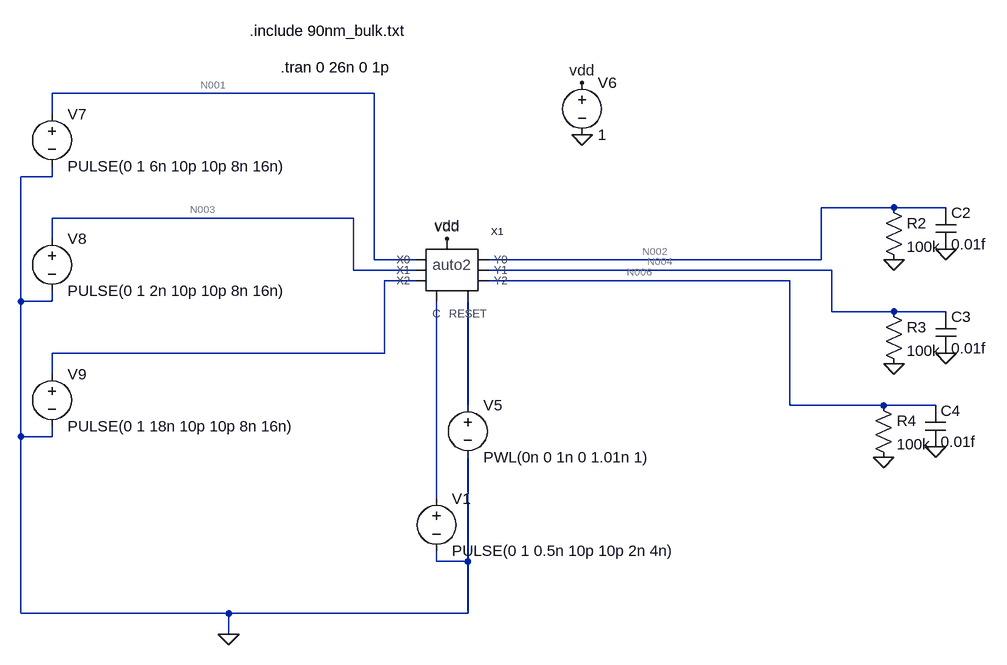
[diagram p0: schematic 4_exp1.asc]
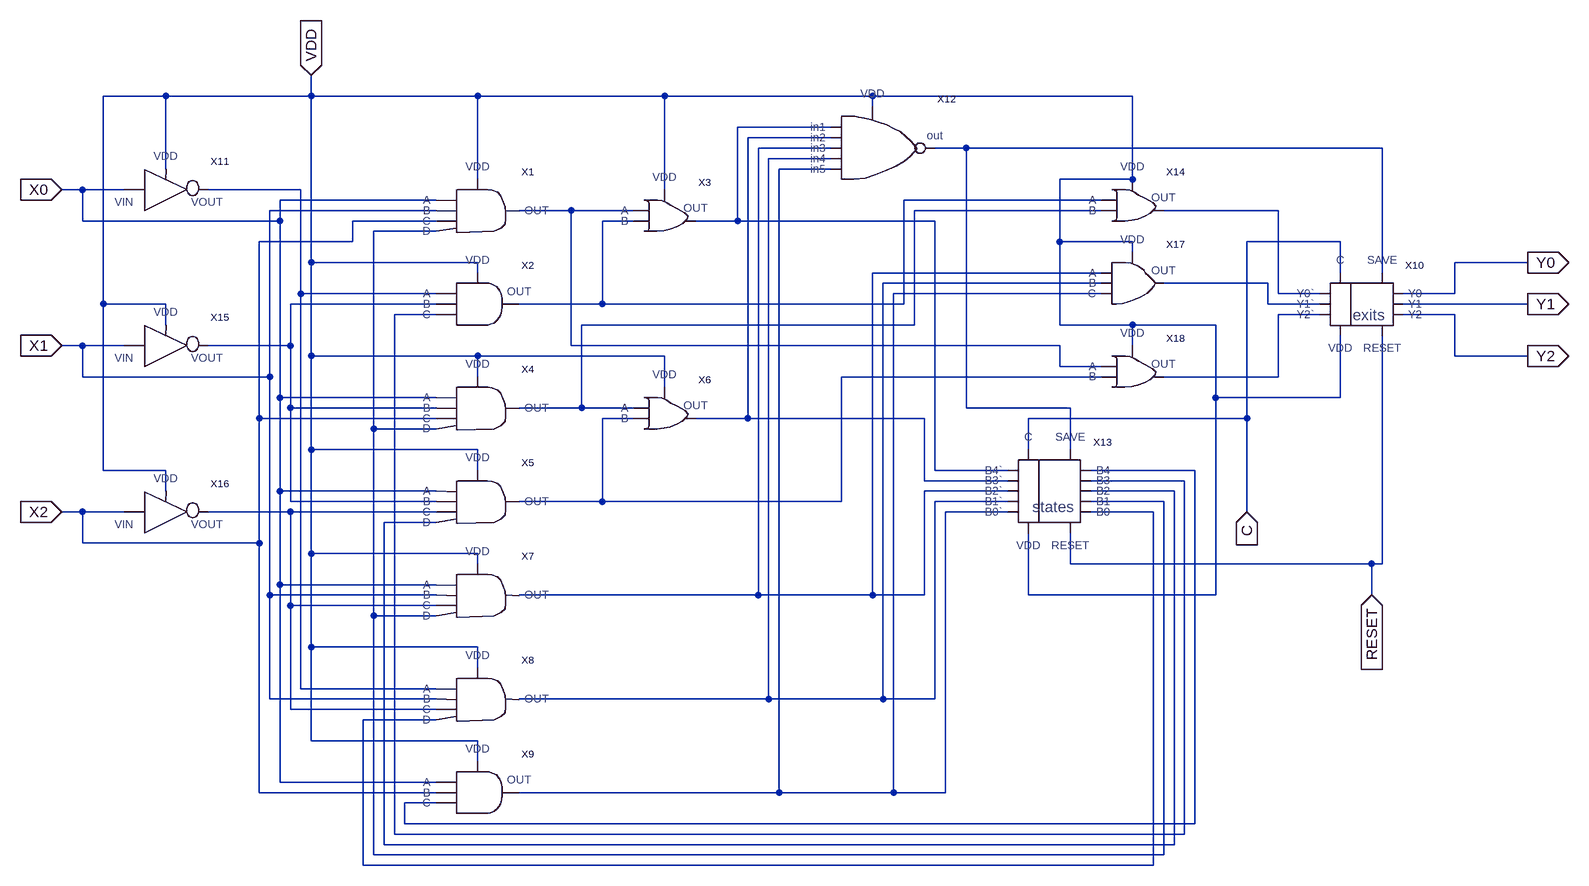
[diagram p1: sub-circuit 4_automat2.asc]
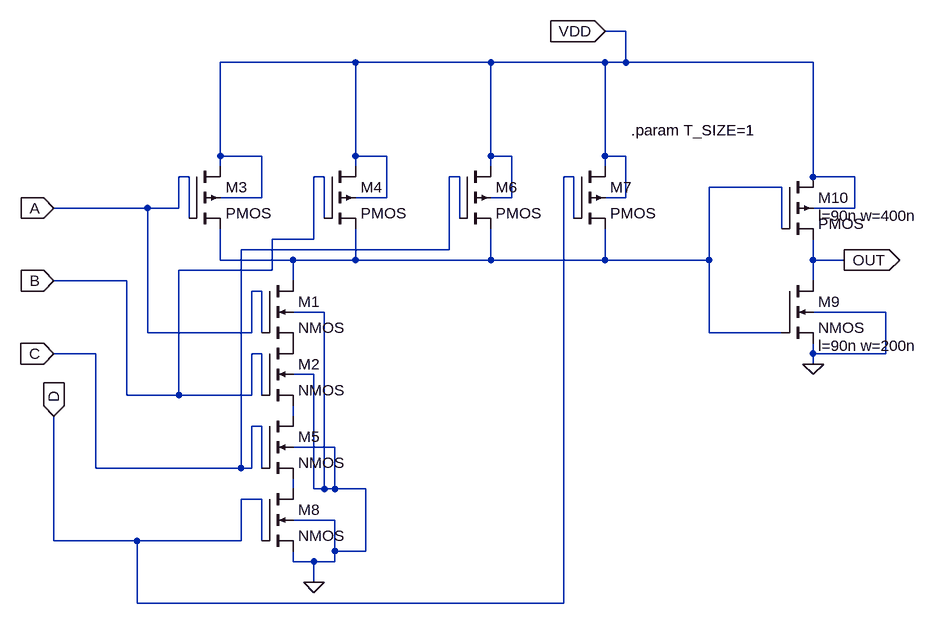
[diagram p2: sub-circuit and4.asc]
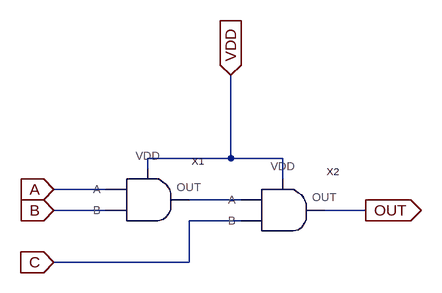
[diagram p3: sub-circuit and3.asc]
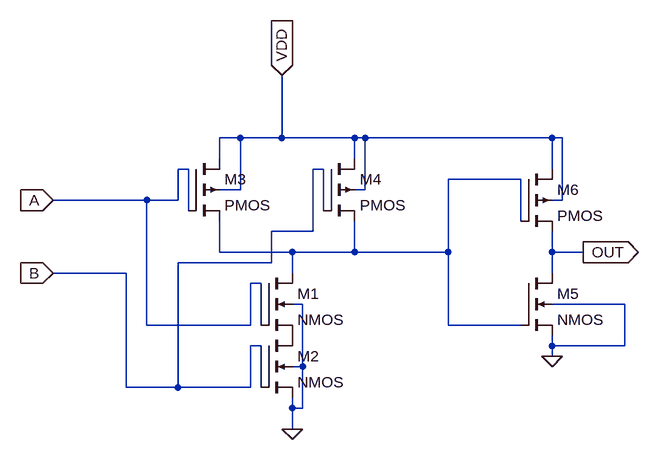
[diagram p4: sub-circuit and.asc]
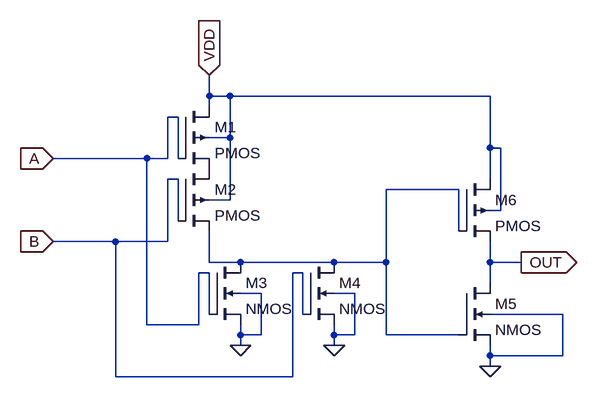
[diagram p5: sub-circuit or.asc]
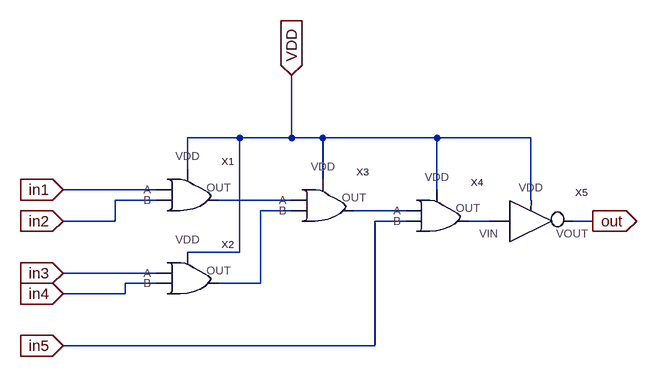
[diagram p6: sub-circuit nor5.asc]
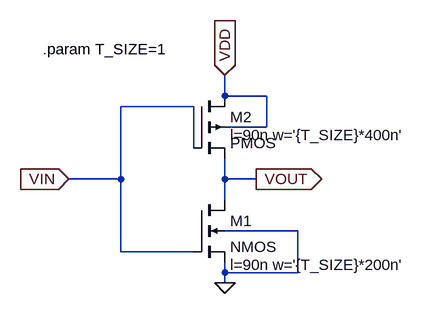
[diagram p7: sub-circuit inverter.asc]
4_exp1.asc, the LTspice schematic file:
Version 4
SHEET 1 2144 680
WIRE 1200 -176 704 -176
WIRE 704 -144 704 -176
WIRE 704 -48 704 -64
WIRE 704 -48 656 -48
WIRE 2000 0 1888 0
WIRE 2080 0 2000 0
WIRE 1168 16 704 16
WIRE 704 48 704 16
WIRE 1200 80 1200 -176
WIRE 1264 80 1200 80
WIRE 1888 80 1888 0
WIRE 1888 80 1376 80
WIRE 1168 96 1168 16
WIRE 1264 96 1168 96
WIRE 1904 96 1376 96
WIRE 1264 112 1216 112
WIRE 1840 112 1376 112
WIRE 656 144 656 -48
WIRE 704 144 704 128
WIRE 704 144 656 144
WIRE 1904 160 1904 96
WIRE 2000 160 1904 160
WIRE 2080 160 2000 160
WIRE 1216 224 1216 112
WIRE 1216 224 704 224
WIRE 704 256 704 224
WIRE 1344 304 1344 144
WIRE 1840 304 1840 112
WIRE 1984 304 1840 304
WIRE 2064 304 1984 304
WIRE 656 352 656 144
WIRE 704 352 704 336
WIRE 704 352 656 352
WIRE 1296 448 1296 144
WIRE 1296 544 1296 528
WIRE 1344 544 1344 384
WIRE 1344 544 1296 544
WIRE 656 624 656 352
WIRE 976 624 656 624
WIRE 1344 624 1344 544
WIRE 1344 624 976 624
WIRE 976 656 976 624
FLAG 1520 -192 vdd
FLAG 1520 -112 0
FLAG 976 656 0
FLAG 2000 80 0
FLAG 2080 64 0
FLAG 2000 240 0
FLAG 2080 224 0
FLAG 1984 384 0
FLAG 2064 368 0
FLAG 1312 48 vdd
SYMBOL voltage 1344 288 R0
WINDOW 123 0 0 Left 2
WINDOW 39 0 0 Left 2
SYMATTR InstName V5
SYMATTR Value PWL(0n 0 1n 0 1.01n 1)
SYMBOL voltage 1520 -208 R0
WINDOW 123 0 0 Left 2
WINDOW 39 0 0 Left 2
SYMATTR InstName V6
SYMATTR Value 1
SYMBOL voltage 1296 432 R0
WINDOW 123 0 0 Left 2
WINDOW 39 0 0 Left 2
SYMATTR InstName V1
SYMATTR Value PULSE(0 1 0.5n 10p 10p 2n 4n)
SYMBOL voltage 704 -160 R0
WINDOW 123 0 0 Left 2
WINDOW 39 0 0 Left 2
SYMATTR InstName V7
SYMATTR Value PULSE(0 1 6n 10p 10p 8n 16n)
SYMBOL voltage 704 32 R0
WINDOW 123 0 0 Left 2
WINDOW 39 0 0 Left 2
SYMATTR InstName V8
SYMATTR Value PULSE(0 1 2n 10p 10p 8n 16n)
SYMBOL voltage 704 240 R0
WINDOW 123 0 0 Left 2
WINDOW 39 0 0 Left 2
SYMATTR InstName V9
SYMATTR Value PULSE(0 1 18n 10p 10p 8n 16n)
SYMBOL res 1984 -16 R0
SYMATTR InstName R2
SYMATTR Value 100k
SYMBOL cap 2064 0 R0
SYMATTR InstName C2
SYMATTR Value 0.01f
SYMBOL res 1984 144 R0
SYMATTR InstName R3
SYMATTR Value 100k
SYMBOL cap 2064 160 R0
SYMATTR InstName C3
SYMATTR Value 0.01f
SYMBOL res 1968 288 R0
SYMATTR InstName R4
SYMATTR Value 100k
SYMBOL cap 2048 304 R0
SYMATTR InstName C4
SYMATTR Value 0.01f
SYMBOL 4_automat2 1312 112 R0
SYMATTR InstName X1
TEXT 1008 -272 Left 2 !.include 90nm_bulk.txt
TEXT 1056 -216 Left 2 !.tran 0 26n 0 1p

4_automat2.asc, the sub-circuit schematic file:
Version 4
SHEET 1 2060 1044
WIRE -288 -144 -384 -144
WIRE -64 -144 -64 -176
WIRE -64 -144 -288 -144
WIRE 192 -144 -64 -144
WIRE 480 -144 192 -144
WIRE 800 -144 480 -144
WIRE 1200 -144 800 -144
WIRE 800 -128 800 -144
WIRE 736 -96 592 -96
WIRE 736 -80 608 -80
WIRE 736 -64 624 -64
WIRE 944 -64 896 -64
WIRE 1584 -64 944 -64
WIRE 736 -48 640 -48
WIRE -288 -32 -288 -144
WIRE 736 -32 656 -32
WIRE 192 -16 192 -144
WIRE 1200 -16 1200 -144
WIRE 1200 -16 1088 -16
WIRE -416 0 -448 0
WIRE -352 0 -416 0
WIRE -80 0 -224 0
WIRE 480 0 480 -144
WIRE 128 16 -112 16
WIRE 1152 16 848 16
WIRE 128 32 -128 32
WIRE 336 32 256 32
WIRE 432 32 336 32
WIRE 1152 32 864 32
WIRE 1424 32 1248 32
WIRE -416 48 -416 0
WIRE -112 48 -112 16
WIRE -112 48 -416 48
WIRE 128 48 0 48
WIRE 432 48 384 48
WIRE 592 48 592 -96
WIRE 592 48 528 48
WIRE 896 48 592 48
WIRE 128 64 32 64
WIRE 0 80 0 48
WIRE 0 80 -144 80
WIRE 1088 80 1088 -16
WIRE 1200 80 1088 80
WIRE 1520 80 1376 80
WIRE 1200 96 1200 80
WIRE -64 112 -64 -144
WIRE 192 112 -64 112
WIRE 1808 112 1696 112
WIRE 192 128 192 112
WIRE 1152 128 800 128
WIRE 1520 128 1520 80
WIRE 1584 128 1584 -64
WIRE 1152 144 816 144
WIRE 1408 144 1248 144
WIRE -80 160 -80 0
WIRE 128 160 -80 160
WIRE 1152 160 832 160
WIRE 1424 160 1424 32
WIRE 1488 160 1424 160
WIRE 1696 160 1696 112
WIRE 1696 160 1616 160
WIRE -384 176 -384 -144
WIRE -288 176 -384 176
WIRE 128 176 -96 176
WIRE 384 176 384 48
WIRE 384 176 256 176
WIRE 848 176 848 16
WIRE 848 176 384 176
WIRE 1408 176 1408 144
WIRE 1488 176 1408 176
WIRE 1808 176 1616 176
WIRE 128 192 64 192
WIRE 1488 192 1424 192
WIRE 1696 192 1616 192
WIRE -288 208 -288 176
WIRE 864 208 864 32
WIRE 864 208 352 208
WIRE 1088 208 1088 80
WIRE 1200 208 1088 208
WIRE 1328 208 1200 208
WIRE -416 240 -448 240
WIRE -352 240 -416 240
WIRE -96 240 -96 176
WIRE -96 240 -224 240
WIRE 336 240 336 32
WIRE 1088 240 336 240
WIRE 1200 240 1200 208
WIRE -64 256 -64 112
WIRE 192 256 -64 256
WIRE 480 256 192 256
WIRE 1696 256 1696 192
WIRE 1808 256 1696 256
WIRE 1088 272 1088 240
WIRE 1152 272 1088 272
WIRE -416 288 -416 240
WIRE -128 288 -128 32
WIRE -128 288 -416 288
WIRE 192 288 192 256
WIRE 1152 288 752 288
WIRE 1424 288 1424 192
WIRE 1424 288 1248 288
WIRE 480 304 480 256
WIRE -112 320 -112 48
WIRE 128 320 -112 320
WIRE 1328 320 1328 208
WIRE 1520 320 1520 224
WIRE 1520 320 1328 320
WIRE -96 336 -96 240
WIRE 128 336 -96 336
WIRE 352 336 352 208
WIRE 352 336 256 336
WIRE 432 336 352 336
WIRE 944 336 944 -64
WIRE 1104 336 944 336
WIRE -144 352 -144 80
WIRE 128 352 -144 352
WIRE 432 352 384 352
WIRE 608 352 608 -80
WIRE 608 352 528 352
WIRE 880 352 608 352
WIRE 1376 352 1376 80
WIRE 1376 352 1040 352
WIRE 32 368 32 64
WIRE 128 368 32 368
WIRE -64 400 -64 256
WIRE 192 400 -64 400
WIRE 1040 400 1040 352
WIRE 1104 400 1104 336
WIRE -384 432 -384 176
WIRE -288 432 -384 432
WIRE 192 432 192 400
WIRE 896 432 896 48
WIRE 1008 432 896 432
WIRE 1296 432 1136 432
WIRE 880 448 880 352
WIRE 1008 448 880 448
WIRE 1280 448 1136 448
WIRE -288 464 -288 432
WIRE -112 464 -112 320
WIRE 128 464 -112 464
WIRE 1008 464 880 464
WIRE 1264 464 1136 464
WIRE -96 480 -96 336
WIRE 128 480 -96 480
WIRE 384 480 384 352
WIRE 384 480 256 480
WIRE 752 480 752 288
WIRE 752 480 384 480
WIRE 1008 480 896 480
WIRE 1248 480 1136 480
WIRE -416 496 -448 496
WIRE -352 496 -416 496
WIRE -96 496 -224 496
WIRE 128 496 -96 496
WIRE 1008 496 912 496
WIRE 1232 496 1136 496
WIRE 1376 496 1376 352
WIRE 128 512 48 512
WIRE -416 544 -416 496
WIRE -144 544 -144 352
WIRE -144 544 -416 544
WIRE -64 560 -64 400
WIRE 192 560 -64 560
WIRE 192 576 192 560
WIRE 1104 576 1104 528
WIRE 1568 576 1104 576
WIRE 1584 576 1584 224
WIRE 1584 576 1568 576
WIRE -112 608 -112 464
WIRE 128 608 -112 608
WIRE -128 624 -128 288
WIRE 128 624 -128 624
WIRE 624 624 624 -64
WIRE 624 624 256 624
WIRE 800 624 800 128
WIRE 800 624 624 624
WIRE 880 624 880 464
WIRE 880 624 800 624
WIRE 1040 624 1040 528
WIRE 1328 624 1328 320
WIRE 1328 624 1040 624
WIRE 1568 624 1568 576
WIRE -96 640 -96 496
WIRE 128 640 -96 640
WIRE 32 656 32 368
WIRE 128 656 32 656
WIRE -64 704 -64 560
WIRE 192 704 -64 704
WIRE 192 736 192 704
WIRE -80 768 -80 160
WIRE 128 768 -80 768
WIRE -128 784 -128 624
WIRE 128 784 -128 784
WIRE 640 784 640 -48
WIRE 640 784 256 784
WIRE 816 784 816 144
WIRE 816 784 640 784
WIRE 896 784 896 480
WIRE 896 784 816 784
WIRE -96 800 -96 640
WIRE 128 800 -96 800
WIRE 128 816 16 816
WIRE -64 848 -64 704
WIRE 192 848 -64 848
WIRE 192 880 192 848
WIRE -112 912 -112 608
WIRE 128 912 -112 912
WIRE -144 928 -144 544
WIRE 128 928 -144 928
WIRE 656 928 656 -32
WIRE 656 928 256 928
WIRE 832 928 832 160
WIRE 832 928 656 928
WIRE 912 928 912 496
WIRE 912 928 832 928
WIRE 128 944 80 944
WIRE 80 976 80 944
WIRE 1296 976 1296 432
WIRE 1296 976 80 976
WIRE 64 992 64 192
WIRE 1280 992 1280 448
WIRE 1280 992 64 992
WIRE 48 1008 48 512
WIRE 1264 1008 1264 464
WIRE 1264 1008 48 1008
WIRE 32 1024 32 656
WIRE 1248 1024 1248 480
WIRE 1248 1024 32 1024
WIRE 16 1040 16 816
WIRE 1232 1040 1232 496
WIRE 1232 1040 16 1040
FLAG 1808 112 Y0
IOPIN 1808 112 Out
FLAG 1808 176 Y1
IOPIN 1808 176 Out
FLAG 1808 256 Y2
IOPIN 1808 256 Out
FLAG 1376 496 C
IOPIN 1376 496 In
FLAG 1568 624 RESET
IOPIN 1568 624 In
FLAG -64 -176 VDD
IOPIN -64 -176 In
FLAG -448 0 X0
IOPIN -448 0 In
FLAG -448 240 X1
IOPIN -448 240 In
FLAG -448 496 X2
IOPIN -448 496 In
SYMBOL and4 208 48 R0
SYMATTR InstName X1
SYMBOL and3 192 176 R0
SYMATTR InstName X2
SYMBOL or 496 48 R0
SYMATTR InstName X3
SYMBOL and4 208 352 R0
SYMATTR InstName X4
SYMBOL and4 208 496 R0
SYMATTR InstName X5
SYMBOL or 496 352 R0
SYMATTR InstName X6
SYMBOL and4 208 640 R0
SYMATTR InstName X7
SYMBOL and4 208 800 R0
SYMATTR InstName X8
SYMBOL and3 192 928 R0
SYMATTR InstName X9
SYMBOL nor5 768 -64 R0
SYMATTR InstName X12
SYMBOL 4_saver 1072 464 R0
SYMATTR InstName X13
SYMBOL 4_exit_saver 1552 192 R0
SYMATTR InstName X10
SYMBOL or 1216 32 R0
SYMATTR InstName X14
SYMBOL or3 1200 144 R0
SYMATTR InstName X17
SYMBOL or 1216 288 R0
SYMATTR InstName X18
SYMBOL inverter -288 0 R0
SYMATTR InstName X11
SYMBOL inverter -288 240 R0
SYMATTR InstName X15
SYMBOL inverter -288 496 R0
SYMATTR InstName X16

and4.asc, the sub-circuit schematic file:
Version 4
SHEET 1 1276 740
WIRE 480 -256 448 -256
WIRE 64 -208 -144 -208
WIRE 272 -208 64 -208
WIRE 448 -208 272 -208
WIRE 480 -208 480 -256
WIRE 480 -208 448 -208
WIRE 768 -208 480 -208
WIRE -144 -64 -144 -208
WIRE -80 -64 -144 -64
WIRE 64 -64 64 -208
WIRE 112 -64 64 -64
WIRE 272 -64 272 -208
WIRE 304 -64 272 -64
WIRE 448 -64 448 -208
WIRE 480 -64 448 -64
WIRE -144 -48 -144 -64
WIRE 64 -48 64 -64
WIRE 272 -48 272 -64
WIRE 448 -48 448 -64
WIRE -192 -32 -208 -32
WIRE 16 -32 0 -32
WIRE 224 -32 208 -32
WIRE 400 -32 384 -32
WIRE 768 -32 768 -208
WIRE 832 -32 768 -32
WIRE 720 -16 608 -16
WIRE -80 0 -80 -64
WIRE -80 0 -144 0
WIRE 112 0 112 -64
WIRE 112 0 64 0
WIRE 304 0 304 -64
WIRE 304 0 272 0
WIRE 480 0 480 -64
WIRE 480 0 448 0
WIRE -256 16 -400 16
WIRE -208 16 -208 -32
WIRE -208 16 -256 16
WIRE 832 16 832 -32
WIRE 832 16 768 16
WIRE -192 32 -192 -32
WIRE 16 32 16 -32
WIRE 224 32 224 -32
WIRE 400 32 400 -32
WIRE 720 48 720 -16
WIRE 0 64 0 -32
WIRE 0 64 -64 64
WIRE 208 80 208 -32
WIRE 208 80 -112 80
WIRE -144 96 -144 48
WIRE -32 96 -144 96
WIRE 64 96 64 48
WIRE 64 96 -32 96
WIRE 272 96 272 48
WIRE 272 96 64 96
WIRE 448 96 448 48
WIRE 448 96 272 96
WIRE 608 96 608 -16
WIRE 608 96 448 96
WIRE 768 96 768 64
WIRE 816 96 768 96
WIRE -64 112 -64 64
WIRE -64 112 -208 112
WIRE -288 128 -400 128
WIRE -32 128 -32 96
WIRE 768 128 768 96
WIRE -80 144 -96 144
WIRE 16 176 -32 176
WIRE 880 176 768 176
WIRE -256 208 -256 16
WIRE -96 208 -96 144
WIRE -96 208 -256 208
WIRE -80 208 -80 144
WIRE 608 208 608 96
WIRE 720 208 608 208
WIRE -336 240 -400 240
WIRE -80 240 -96 240
WIRE 768 240 768 224
WIRE 880 240 880 176
WIRE 880 240 768 240
WIRE 768 256 768 240
WIRE 0 272 -32 272
WIRE -288 304 -288 128
WIRE -208 304 -208 112
WIRE -208 304 -288 304
WIRE -96 304 -96 240
WIRE -96 304 -208 304
WIRE -80 304 -80 240
WIRE -32 336 -32 320
WIRE -80 352 -96 352
WIRE 32 384 -32 384
WIRE -336 416 -336 240
WIRE -112 416 -112 80
WIRE -112 416 -336 416
WIRE -96 416 -96 352
WIRE -96 416 -112 416
WIRE -80 416 -80 352
WIRE -32 448 -32 432
WIRE 0 448 0 272
WIRE 16 448 16 176
WIRE 16 448 0 448
WIRE 32 448 32 384
WIRE 32 448 16 448
WIRE 80 448 32 448
WIRE -80 464 -112 464
WIRE 32 496 -32 496
WIRE -400 528 -400 336
WIRE -272 528 -400 528
WIRE -112 528 -112 464
WIRE -112 528 -272 528
WIRE -80 528 -80 464
WIRE 32 544 32 496
WIRE 80 544 80 448
WIRE 80 544 32 544
WIRE -32 560 -32 544
WIRE 0 560 -32 560
WIRE 32 560 32 544
WIRE 32 560 0 560
WIRE 0 592 0 560
WIRE -272 624 -272 528
WIRE 384 624 384 -32
WIRE 384 624 -272 624
FLAG -400 16 A
IOPIN -400 16 In
FLAG -400 128 B
IOPIN -400 128 In
FLAG -400 240 C
IOPIN -400 240 In
FLAG -400 336 D
IOPIN -400 336 In
FLAG 0 592 0
FLAG 768 256 0
FLAG 816 96 OUT
IOPIN 816 96 Out
FLAG 448 -256 VDD
IOPIN 448 -256 In
SYMBOL nmos4 -80 128 R0
SYMATTR InstName M1
SYMATTR Value2 l=90n w=200n
SYMBOL nmos4 -80 224 R0
SYMATTR InstName M2
SYMATTR Value2 l=90n w=200n
SYMBOL pmos4 -192 -48 R0
SYMATTR InstName M3
SYMATTR Value2 l=90n w=400n
SYMBOL pmos4 16 -48 R0
SYMATTR InstName M4
SYMATTR Value2 l=90n w=400n
SYMBOL nmos4 -80 336 R0
SYMATTR InstName M5
SYMATTR Value2 l=90n w=200n
SYMBOL pmos4 224 -48 R0
SYMATTR InstName M6
SYMATTR Value2 l=90n w=400n
SYMBOL pmos4 400 -48 R0
SYMATTR InstName M7
SYMATTR Value2 l=90n w=400n
SYMBOL nmos4 -80 448 R0
SYMATTR InstName M8
SYMATTR Value2 l=90n w=200n
SYMBOL nmos4 720 128 R0
WINDOW 123 56 100 Left 2
SYMATTR Value2 l=90n w=200n
SYMATTR InstName M9
SYMBOL pmos4 720 -32 R0
WINDOW 123 56 60 Left 2
SYMATTR Value2 l=90n w=400n
SYMATTR InstName M10
TEXT 488 -104 Left 2 !.param T_SIZE=1

and3.asc, the sub-circuit schematic file:
Version 4
SHEET 1 880 680
WIRE 208 16 208 -112
WIRE 208 16 80 16
WIRE 288 16 208 16
WIRE 80 32 80 16
WIRE 288 48 288 16
WIRE 16 64 -64 64
WIRE 224 80 144 80
WIRE 16 96 -64 96
WIRE 416 96 352 96
WIRE 224 112 144 112
WIRE 144 176 144 112
WIRE 144 176 -64 176
FLAG -64 64 A
IOPIN -64 64 In
FLAG -64 96 B
IOPIN -64 96 In
FLAG -64 176 C
IOPIN -64 176 In
FLAG 416 96 OUT
IOPIN 416 96 Out
FLAG 208 -112 VDD
IOPIN 208 -112 In
SYMBOL and 64 80 R0
SYMATTR InstName X1
SYMBOL and 272 96 R0
SYMATTR InstName X2

and.asc, the sub-circuit schematic file:
Version 4
SHEET 1 1116 788
WIRE 112 -32 80 -32
WIRE 176 -32 176 -128
WIRE 176 -32 112 -32
WIRE 288 -32 176 -32
WIRE 304 -32 288 -32
WIRE 592 -32 304 -32
WIRE 608 -32 592 -32
WIRE 80 0 80 -32
WIRE 288 0 288 -32
WIRE 32 16 16 16
WIRE 240 16 224 16
WIRE 592 16 592 -32
WIRE 544 32 432 32
WIRE 112 48 112 -32
WIRE 112 48 80 48
WIRE 304 48 304 -32
WIRE 304 48 288 48
WIRE -32 64 -176 64
WIRE 16 64 16 16
WIRE 16 64 -32 64
WIRE 608 64 608 -32
WIRE 608 64 592 64
WIRE 32 80 32 16
WIRE 240 80 240 16
WIRE 544 96 544 32
WIRE 224 112 224 16
WIRE 224 112 160 112
WIRE 80 144 80 96
WIRE 192 144 80 144
WIRE 288 144 288 96
WIRE 288 144 192 144
WIRE 432 144 432 32
WIRE 432 144 288 144
WIRE 592 144 592 112
WIRE 640 144 592 144
WIRE 160 160 160 112
WIRE 160 160 16 160
WIRE -64 176 -176 176
WIRE 192 176 192 144
WIRE 592 176 592 144
WIRE 144 192 128 192
WIRE 208 224 192 224
WIRE 704 224 592 224
WIRE -32 256 -32 64
WIRE 128 256 128 192
WIRE 128 256 -32 256
WIRE 144 256 144 192
WIRE 432 256 432 144
WIRE 544 256 432 256
WIRE 144 288 128 288
WIRE 592 288 592 272
WIRE 704 288 704 224
WIRE 704 288 592 288
WIRE 592 304 592 288
WIRE 208 320 208 224
WIRE 208 320 192 320
WIRE -64 352 -64 176
WIRE 16 352 16 160
WIRE 16 352 -64 352
WIRE 128 352 128 288
WIRE 128 352 16 352
WIRE 144 352 144 288
WIRE 192 384 192 368
WIRE 208 384 208 320
WIRE 208 384 192 384
WIRE 192 416 192 384
FLAG 192 416 0
FLAG -176 64 A
IOPIN -176 64 In
FLAG -176 176 B
IOPIN -176 176 In
FLAG 176 -128 VDD
IOPIN 176 -128 In
FLAG 592 304 0
FLAG 640 144 OUT
IOPIN 640 144 Out
SYMBOL nmos4 144 176 R0
SYMATTR InstName M1
SYMATTR Value2 l=90n w=200n
SYMBOL nmos4 144 272 R0
SYMATTR InstName M2
SYMATTR Value2 l=90n w=200n
SYMBOL pmos4 32 0 R0
SYMATTR InstName M3
SYMATTR Value2 l=90n w=400n
SYMBOL pmos4 240 0 R0
SYMATTR InstName M4
SYMATTR Value2 l=90n w=400n
SYMBOL nmos4 544 176 R0
SYMATTR Value2 l=90n w=200n
SYMATTR InstName M5
SYMBOL pmos4 544 16 R0
SYMATTR Value2 l=90n w=400n
SYMATTR InstName M6

or.asc, the sub-circuit schematic file:
Version 4
SHEET 1 1084 680
WIRE 32 -32 32 -64
WIRE 64 -32 32 -32
WIRE 464 -32 64 -32
WIRE 32 -16 32 -32
WIRE -16 0 -32 0
WIRE 64 32 64 -32
WIRE 64 32 32 32
WIRE 464 48 464 -32
WIRE 480 48 464 48
WIRE -64 64 -208 64
WIRE -32 64 -32 0
WIRE -32 64 -64 64
WIRE -16 64 -16 0
WIRE -16 96 -32 96
WIRE 464 96 464 48
WIRE 416 112 304 112
WIRE 64 128 64 32
WIRE 64 128 32 128
WIRE 480 144 480 48
WIRE 480 144 464 144
WIRE -16 160 -16 96
WIRE 416 176 416 112
WIRE -112 192 -208 192
WIRE -32 192 -32 96
WIRE -32 192 -112 192
WIRE 32 224 32 176
WIRE 80 224 32 224
WIRE 224 224 80 224
WIRE 304 224 304 112
WIRE 304 224 224 224
WIRE 464 224 464 192
WIRE 512 224 464 224
WIRE 32 240 16 240
WIRE 176 240 160 240
WIRE 464 256 464 224
WIRE 112 272 80 272
WIRE 256 272 224 272
WIRE 32 304 32 240
WIRE 176 304 176 240
WIRE 576 304 464 304
WIRE -64 320 -64 64
WIRE 16 320 16 240
WIRE 16 320 -64 320
WIRE 80 336 80 320
WIRE 112 336 112 272
WIRE 112 336 80 336
WIRE 224 336 224 320
WIRE 256 336 256 272
WIRE 256 336 224 336
WIRE 304 336 304 224
WIRE 416 336 304 336
WIRE 80 352 80 336
WIRE 224 352 224 336
WIRE 464 368 464 352
WIRE 576 368 576 304
WIRE 576 368 464 368
WIRE 464 384 464 368
WIRE -112 400 -112 192
WIRE 160 400 160 240
WIRE 160 400 -112 400
FLAG 32 -64 VDD
IOPIN 32 -64 In
FLAG 80 352 0
FLAG 224 352 0
FLAG -208 64 A
IOPIN -208 64 In
FLAG -208 192 B
IOPIN -208 192 In
FLAG 464 384 0
FLAG 512 224 OUT
IOPIN 512 224 Out
SYMBOL pmos4 -16 -16 R0
SYMATTR InstName M1
SYMATTR Value2 l=90n w=400n
SYMBOL pmos4 -16 80 R0
SYMATTR InstName M2
SYMATTR Value2 l=90n w=400n
SYMBOL nmos4 32 224 R0
SYMATTR InstName M3
SYMATTR Value2 l=90n w=200n
SYMBOL nmos4 176 224 R0
SYMATTR InstName M4
SYMATTR Value2 l=90n w=200n
SYMBOL nmos4 416 256 R0
SYMATTR Value2 l=90n w=200n
SYMATTR InstName M5
SYMBOL pmos4 416 96 R0
SYMATTR Value2 l=90n w=400n
SYMATTR InstName M6

nor5.asc, the sub-circuit schematic file:
Version 4
SHEET 1 880 680
WIRE 192 16 112 16
WIRE 272 16 272 -80
WIRE 272 16 192 16
WIRE 320 16 272 16
WIRE 496 16 320 16
WIRE 640 16 496 16
WIRE 112 64 112 16
WIRE 320 80 320 16
WIRE 64 96 -80 96
WIRE 496 96 496 16
WIRE 64 112 0 112
WIRE 272 112 160 112
WIRE 640 112 640 16
WIRE 272 128 224 128
WIRE 448 128 368 128
WIRE 0 144 0 112
WIRE 0 144 -80 144
WIRE 448 144 400 144
WIRE 576 144 544 144
WIRE 736 144 704 144
WIRE 192 192 192 16
WIRE 192 192 112 192
WIRE 64 224 -80 224
WIRE 64 240 16 240
WIRE 224 240 224 128
WIRE 224 240 160 240
WIRE 16 256 16 240
WIRE 16 256 -80 256
WIRE 400 336 400 144
WIRE 400 336 -80 336
FLAG -80 96 in1
IOPIN -80 96 In
FLAG -80 144 in2
IOPIN -80 144 In
FLAG -80 224 in3
IOPIN -80 224 In
FLAG -80 256 in4
IOPIN -80 256 In
FLAG -80 336 in5
IOPIN -80 336 In
FLAG 272 -80 VDD
IOPIN 272 -80 In
FLAG 736 144 out
IOPIN 736 144 Out
SYMBOL or 128 112 R0
SYMATTR InstName X1
SYMBOL or 128 240 R0
SYMATTR InstName X2
SYMBOL or 336 128 R0
SYMATTR InstName X3
SYMBOL or 512 144 R0
SYMATTR InstName X4
SYMBOL inverter 640 144 R0
SYMATTR InstName X5

inverter.asc, the sub-circuit schematic file:
Version 4
SHEET 1 880 680
WIRE 176 -128 176 -160
WIRE 240 -128 176 -128
WIRE 128 -112 16 -112
WIRE 240 -80 240 -128
WIRE 240 -80 176 -80
WIRE 128 -48 128 -112
WIRE 16 0 16 -112
WIRE 16 0 -64 0
WIRE 176 0 176 -32
WIRE 224 0 176 0
WIRE 176 32 176 0
WIRE 288 80 176 80
WIRE 16 112 16 0
WIRE 128 112 16 112
WIRE 176 144 176 128
WIRE 288 144 288 80
WIRE 288 144 176 144
WIRE 176 160 176 144
FLAG 176 160 0
FLAG -64 0 VIN
IOPIN -64 0 In
FLAG 224 0 VOUT
IOPIN 224 0 Out
FLAG 176 -160 VDD
IOPIN 176 -160 In
SYMBOL nmos4 128 32 R0
WINDOW 123 56 100 Left 2
SYMATTR InstName M1
SYMATTR Value2 l=90n w='{T_SIZE}*200n'
SYMBOL pmos4 128 -128 R0
WINDOW 123 56 60 Left 2
SYMATTR InstName M2
SYMATTR Value2 l=90n w='{T_SIZE}*400n'
TEXT -104 -200 Left 2 !.param T_SIZE=1

4_saver.asc, the sub-circuit schematic file:
Version 4
SHEET 1 2252 1400
WIRE 960 -304 896 -304
WIRE 1136 -304 1136 -400
WIRE 1136 -304 960 -304
WIRE 960 -288 960 -304
WIRE 896 -256 896 -304
WIRE 912 -256 896 -256
WIRE 848 -240 848 -352
WIRE 912 -240 848 -240
WIRE 1024 -240 1008 -240
WIRE 1120 -112 880 -112
WIRE 1136 -112 1136 -304
WIRE 1136 -112 1120 -112
WIRE 1264 -112 1136 -112
WIRE 880 -80 880 -112
WIRE 1120 -64 1120 -112
WIRE 736 -48 736 -352
WIRE 816 -48 736 -48
WIRE 960 -32 944 -32
WIRE 1056 -32 960 -32
WIRE 816 -16 784 -16
WIRE 1408 -16 1184 -16
WIRE 1024 0 1024 -240
WIRE 1056 0 1024 0
WIRE 960 32 960 -32
WIRE 960 32 816 32
WIRE 784 48 784 -16
WIRE 784 48 624 48
WIRE 1120 48 880 48
WIRE 1120 64 1120 48
WIRE 1264 64 1264 -112
WIRE 1264 64 1120 64
WIRE 1488 64 1264 64
WIRE 816 80 816 32
WIRE 976 80 944 80
WIRE 976 96 976 80
WIRE 1056 96 976 96
WIRE 1488 96 1488 64
WIRE 1296 112 1184 112
WIRE 1024 128 1024 0
WIRE 1056 128 1024 128
WIRE 1408 128 1408 -16
WIRE 1440 128 1408 128
WIRE 1632 128 1536 128
WIRE 1376 144 1376 -64
WIRE 1440 144 1376 144
WIRE 1296 160 1296 112
WIRE 1440 160 1296 160
WIRE 1584 160 1536 160
WIRE 1120 192 880 192
WIRE 1264 192 1264 64
WIRE 1264 192 1120 192
WIRE 1488 192 1264 192
WIRE 1120 208 1120 192
WIRE 736 224 736 -48
WIRE 816 224 736 224
WIRE 1056 240 944 240
WIRE 1488 240 1488 192
WIRE 816 256 768 256
WIRE 1408 256 1184 256
WIRE 1024 272 1024 128
WIRE 1056 272 1024 272
WIRE 1408 272 1408 256
WIRE 1440 272 1408 272
WIRE 1632 272 1536 272
WIRE 944 288 944 240
WIRE 944 288 816 288
WIRE 1376 288 1376 144
WIRE 1440 288 1376 288
WIRE 768 304 768 256
WIRE 768 304 624 304
WIRE 1440 304 1408 304
WIRE 1584 304 1536 304
WIRE 1120 320 880 320
WIRE 1264 320 1264 192
WIRE 1264 320 1120 320
WIRE 1120 336 1120 320
WIRE 816 352 816 288
WIRE 944 368 944 352
WIRE 1056 368 944 368
WIRE 1408 384 1408 304
WIRE 1408 384 1184 384
WIRE 1024 400 1024 272
WIRE 1056 400 1024 400
WIRE 1264 400 1264 320
WIRE 1488 400 1264 400
WIRE 1440 432 1280 432
WIRE 1632 432 1536 432
WIRE 1376 448 1376 288
WIRE 1440 448 1376 448
WIRE 1120 464 880 464
WIRE 1440 464 1296 464
WIRE 1584 464 1536 464
WIRE 1120 480 1120 464
WIRE 1264 480 1264 400
WIRE 1264 480 1120 480
WIRE 736 496 736 224
WIRE 816 496 736 496
WIRE 1056 512 944 512
WIRE 816 528 768 528
WIRE 1280 528 1280 432
WIRE 1280 528 1184 528
WIRE 1024 544 1024 400
WIRE 1056 544 1024 544
WIRE 1264 544 1264 480
WIRE 1488 544 1264 544
WIRE 944 560 944 512
WIRE 944 560 816 560
WIRE 768 576 768 528
WIRE 768 576 624 576
WIRE 1440 576 1312 576
WIRE 1632 576 1536 576
WIRE 1120 592 880 592
WIRE 1264 592 1264 544
WIRE 1264 592 1120 592
WIRE 1376 592 1376 448
WIRE 1440 592 1376 592
WIRE 1120 608 1120 592
WIRE 1440 608 1328 608
WIRE 1584 608 1536 608
WIRE 816 624 816 560
WIRE 944 640 944 624
WIRE 1056 640 944 640
WIRE 1296 656 1296 464
WIRE 1296 656 1184 656
WIRE 1024 672 1024 544
WIRE 1056 672 1024 672
WIRE 1264 688 1264 592
WIRE 1488 688 1264 688
WIRE 1440 720 1360 720
WIRE 1632 720 1536 720
WIRE 1120 736 880 736
WIRE 1264 736 1264 688
WIRE 1264 736 1120 736
WIRE 1376 736 1376 592
WIRE 1440 736 1376 736
WIRE 1120 752 1120 736
WIRE 1440 752 1392 752
WIRE 1584 752 1536 752
WIRE 736 768 736 496
WIRE 816 768 736 768
WIRE 1056 784 944 784
WIRE 816 800 768 800
WIRE 1312 800 1312 576
WIRE 1312 800 1184 800
WIRE 1024 816 1024 672
WIRE 1056 816 1024 816
WIRE 768 832 768 800
WIRE 768 832 624 832
WIRE 944 832 944 784
WIRE 944 832 816 832
WIRE 1120 864 880 864
WIRE 1264 864 1264 736
WIRE 1264 864 1120 864
WIRE 1120 880 1120 864
WIRE 816 896 816 832
WIRE 944 912 944 896
WIRE 1056 912 944 912
WIRE 1328 928 1328 608
WIRE 1328 928 1184 928
WIRE 1024 944 1024 816
WIRE 1056 944 1024 944
WIRE 1008 1024 880 1024
WIRE 1120 1024 1008 1024
WIRE 1264 1024 1264 864
WIRE 1264 1024 1120 1024
WIRE 880 1040 880 1024
WIRE 1120 1056 1120 1024
WIRE 736 1072 736 768
WIRE 816 1072 736 1072
WIRE 960 1088 944 1088
WIRE 1056 1088 976 1088
WIRE 816 1104 768 1104
WIRE 1360 1104 1360 720
WIRE 1360 1104 1184 1104
WIRE 1024 1120 1024 944
WIRE 1056 1120 1024 1120
WIRE 768 1136 768 1104
WIRE 768 1136 624 1136
WIRE 960 1136 960 1088
WIRE 960 1136 800 1136
WIRE 1264 1168 1264 1024
WIRE 1264 1168 1120 1168
WIRE 992 1184 880 1184
WIRE 1008 1184 1008 1024
WIRE 1008 1184 992 1184
WIRE 1120 1184 1120 1168
WIRE 736 1200 736 1072
WIRE 736 1200 608 1200
WIRE 800 1216 800 1136
WIRE 832 1216 800 1216
WIRE 1056 1216 1008 1216
WIRE 832 1232 784 1232
WIRE 976 1232 976 1088
WIRE 976 1232 928 1232
WIRE 1392 1232 1392 752
WIRE 1392 1232 1184 1232
WIRE 1024 1248 1024 1120
WIRE 1056 1248 1024 1248
WIRE 928 1264 928 1232
WIRE 928 1264 832 1264
WIRE 992 1296 992 1184
WIRE 992 1296 688 1296
WIRE 992 1312 992 1296
WIRE 992 1312 928 1312
WIRE 688 1328 688 1296
WIRE 832 1344 832 1264
WIRE 864 1344 832 1344
WIRE 1008 1344 1008 1216
WIRE 1008 1344 992 1344
WIRE 608 1360 608 1200
WIRE 624 1360 608 1360
WIRE 784 1360 784 1232
WIRE 784 1360 752 1360
FLAG 1376 -64 C
IOPIN 1376 -64 In
FLAG 1632 128 B4
IOPIN 1632 128 Out
FLAG 1632 272 B3
IOPIN 1632 272 Out
FLAG 1632 432 B2
IOPIN 1632 432 Out
FLAG 1632 576 B1
IOPIN 1632 576 Out
FLAG 1632 720 B0
IOPIN 1632 720 Out
FLAG 848 -352 SAVE
IOPIN 848 -352 In
FLAG 736 -352 RESET
IOPIN 736 -352 In
FLAG 624 48 B4`
IOPIN 624 48 In
FLAG 624 576 B2`
IOPIN 624 576 In
FLAG 624 304 B3`
IOPIN 624 304 In
FLAG 624 832 B1`
IOPIN 624 832 In
FLAG 624 1136 B0`
IOPIN 624 1136 In
FLAG 1136 -400 VDD
IOPIN 1136 -400 In
SYMBOL and 864 -32 R0
SYMATTR InstName X15
SYMBOL and 1104 -16 R0
SYMATTR InstName X17
SYMBOL and 1104 112 R0
SYMATTR InstName X18
SYMBOL and 864 240 R0
SYMATTR InstName X24
SYMBOL and 1104 256 R0
SYMATTR InstName X26
SYMBOL and 1104 384 R0
SYMATTR InstName X27
SYMBOL and 864 512 R0
SYMATTR InstName X28
SYMBOL and 1104 528 R0
SYMATTR InstName X30
SYMBOL and 1104 656 R0
SYMATTR InstName X31
SYMBOL and 864 784 R0
SYMATTR InstName X32
SYMBOL and 1104 800 R0
SYMATTR InstName X34
SYMBOL and 1104 928 R0
SYMATTR InstName X35
SYMBOL jk-front 1488 160 R0
SYMATTR InstName X19
SYMBOL jk-front 1488 304 R0
SYMATTR InstName X20
SYMBOL jk-front 1488 464 R0
SYMATTR InstName X21
SYMBOL jk-front 1488 608 R0
SYMATTR InstName X22
SYMBOL jk-front 1488 752 R0
SYMATTR InstName X23
SYMBOL and 864 1088 R0
SYMATTR InstName X14
SYMBOL and 1104 1104 R0
SYMATTR InstName X38
SYMBOL and 1104 1232 R0
SYMATTR InstName X39
SYMBOL xor 960 -240 R0
SYMATTR InstName X40
SYMBOL inverter 880 80 R0
SYMATTR InstName X1
SYMBOL inverter 880 352 R0
SYMATTR InstName X2
SYMBOL inverter 880 624 R0
SYMATTR InstName X3
SYMBOL inverter 880 896 R0
SYMATTR InstName X4
SYMBOL or 896 1232 R0
SYMATTR InstName X5
SYMBOL inverter 688 1360 R0
SYMATTR InstName X6
SYMBOL inverter 928 1344 R0
SYMATTR InstName X7

jk-front.asc, the sub-circuit schematic file:
Version 4
SHEET 1 1588 680
WIRE 1472 -48 -32 -48
WIRE 192 0 80 0
WIRE 352 0 192 0
WIRE 592 0 592 -272
WIRE 592 0 352 0
WIRE 688 0 592 0
WIRE 1008 0 688 0
WIRE 1280 0 1008 0
WIRE 80 16 80 0
WIRE 352 32 352 0
WIRE -32 48 -32 -48
WIRE 16 48 -32 48
WIRE 688 48 688 0
WIRE 288 64 144 64
WIRE 1008 64 1008 0
WIRE 16 80 -96 80
WIRE 624 80 432 80
WIRE 1280 80 1280 0
WIRE 288 96 208 96
WIRE 816 96 768 96
WIRE 944 96 816 96
WIRE 624 112 576 112
WIRE 1216 112 1088 112
WIRE 944 128 896 128
WIRE 1456 128 1360 128
WIRE 1504 128 1456 128
WIRE 192 144 192 0
WIRE 192 144 16 144
WIRE 1216 144 1168 144
WIRE -80 176 -96 176
WIRE -48 176 -80 176
WIRE 208 176 208 96
WIRE 208 176 80 176
WIRE 816 176 816 96
WIRE 816 176 544 176
WIRE 576 208 576 112
WIRE 848 208 576 208
WIRE 1168 224 1168 144
WIRE 1424 224 1168 224
WIRE 192 240 192 144
WIRE 192 240 80 240
WIRE 320 240 192 240
WIRE 688 240 320 240
WIRE 1008 240 688 240
WIRE 1280 240 1008 240
WIRE 320 256 320 240
WIRE 16 272 -16 272
WIRE 688 272 688 240
WIRE 1360 272 1360 128
WIRE 1360 272 1168 272
WIRE 256 288 144 288
WIRE 1008 288 1008 240
WIRE 16 304 -96 304
WIRE 624 304 400 304
WIRE 1280 304 1280 240
WIRE 208 320 208 176
WIRE 256 320 208 320
WIRE 848 320 848 208
WIRE 848 320 768 320
WIRE 944 320 848 320
WIRE 544 336 544 176
WIRE 624 336 544 336
WIRE 1216 336 1088 336
WIRE 896 352 896 128
WIRE 944 352 896 352
WIRE 1424 352 1424 224
WIRE 1424 352 1360 352
WIRE 1472 352 1472 -48
WIRE 1472 352 1424 352
WIRE 1504 352 1472 352
WIRE 1168 368 1168 272
WIRE 1216 368 1168 368
WIRE -80 480 -80 176
WIRE 896 480 896 352
WIRE 896 480 -80 480
WIRE -16 560 -16 272
WIRE 1456 560 1456 128
WIRE 1456 560 -16 560
FLAG -96 80 J
IOPIN -96 80 In
FLAG -96 176 C
IOPIN -96 176 In
FLAG -96 304 K
IOPIN -96 304 In
FLAG 1504 128 Q
IOPIN 1504 128 Out
FLAG 1504 352 !Q
IOPIN 1504 352 Out
FLAG 592 -272 VDD
IOPIN 592 -272 In
SYMBOL and 64 64 R0
SYMATTR InstName X1
SYMBOL and 64 288 R0
SYMATTR InstName X2
SYMBOL nand 352 80 R0
SYMATTR InstName X3
SYMBOL nand 320 304 R0
SYMATTR InstName X4
SYMBOL nand 688 96 R0
SYMATTR InstName X5
SYMBOL nand 688 320 R0
SYMATTR InstName X6
SYMBOL nand 1008 112 R0
SYMATTR InstName X8
SYMBOL nand 1008 336 R0
SYMATTR InstName X9
SYMBOL nand 1280 128 R0
SYMATTR InstName X10
SYMBOL nand 1280 352 R0
SYMATTR InstName X11
SYMBOL inverter 16 176 R0
SYMATTR InstName X12

nand.asc, the sub-circuit schematic file:
Version 4
SHEET 1 880 680
WIRE 144 -80 112 -80
WIRE 208 -80 208 -176
WIRE 208 -80 144 -80
WIRE 320 -80 208 -80
WIRE 336 -80 320 -80
WIRE 112 -48 112 -80
WIRE 320 -48 320 -80
WIRE 64 -32 48 -32
WIRE 272 -32 256 -32
WIRE 144 0 144 -80
WIRE 144 0 112 0
WIRE 336 0 336 -80
WIRE 336 0 320 0
WIRE 0 16 -144 16
WIRE 48 16 48 -32
WIRE 48 16 0 16
WIRE 64 32 64 -32
WIRE 272 32 272 -32
WIRE 256 64 256 -32
WIRE 256 64 192 64
WIRE 112 96 112 48
WIRE 224 96 112 96
WIRE 320 96 320 48
WIRE 320 96 224 96
WIRE 448 96 320 96
WIRE 192 112 192 64
WIRE 192 112 48 112
WIRE -32 128 -144 128
WIRE 224 128 224 96
WIRE 176 144 160 144
WIRE 240 176 224 176
WIRE 0 208 0 16
WIRE 160 208 160 144
WIRE 160 208 0 208
WIRE 176 208 176 144
WIRE 176 240 160 240
WIRE 240 272 240 176
WIRE 240 272 224 272
WIRE -32 304 -32 128
WIRE 48 304 48 112
WIRE 48 304 -32 304
WIRE 160 304 160 240
WIRE 160 304 48 304
WIRE 176 304 176 240
WIRE 224 336 224 320
WIRE 240 336 240 272
WIRE 240 336 224 336
WIRE 224 368 224 336
FLAG 224 368 0
FLAG 448 96 OUT
IOPIN 448 96 Out
FLAG -144 16 A
IOPIN -144 16 In
FLAG -144 128 B
IOPIN -144 128 In
FLAG 208 -176 VDD
IOPIN 208 -176 In
SYMBOL nmos4 176 128 R0
SYMATTR InstName M1
SYMATTR Value2 l=90n w=200n
SYMBOL nmos4 176 224 R0
SYMATTR InstName M2
SYMATTR Value2 l=90n w=200n
SYMBOL pmos4 64 -48 R0
SYMATTR InstName M3
SYMATTR Value2 l=90n w=400n
SYMBOL pmos4 272 -48 R0
SYMATTR InstName M4
SYMATTR Value2 l=90n w=400n

xor.asc, the sub-circuit schematic file:
Version 4
SHEET 1 1104 680
WIRE 416 -112 416 -208
WIRE 416 -112 240 -112
WIRE 448 -112 416 -112
WIRE 544 -112 448 -112
WIRE 832 -112 544 -112
WIRE 544 -32 544 -112
WIRE 480 0 112 0
WIRE 688 16 624 16
WIRE 480 32 416 32
WIRE 112 48 112 0
WIRE 112 48 80 48
WIRE 240 64 240 -112
WIRE 832 80 832 -112
WIRE 112 96 112 48
WIRE 176 96 112 96
WIRE 416 112 416 32
WIRE 416 112 320 112
WIRE 688 112 688 16
WIRE 768 112 688 112
WIRE 176 128 112 128
WIRE 1008 128 912 128
WIRE 768 144 688 144
WIRE 112 176 112 128
WIRE 112 176 80 176
WIRE 448 192 448 -112
WIRE 544 192 448 192
WIRE 416 224 416 112
WIRE 480 224 416 224
WIRE 688 240 688 144
WIRE 688 240 624 240
WIRE 112 256 112 176
WIRE 480 256 112 256
FLAG 80 48 a
IOPIN 80 48 In
FLAG 80 176 b
IOPIN 80 176 In
FLAG 1008 128 out
IOPIN 1008 128 Out
FLAG 416 -208 vdd
IOPIN 416 -208 In
SYMBOL nand 240 112 R0
SYMATTR InstName X1
SYMBOL nand 544 16 R0
SYMATTR InstName X2
SYMBOL nand 544 240 R0
SYMATTR InstName X3
SYMBOL nand 832 128 R0
SYMATTR InstName X4

4_exit_saver.asc, the sub-circuit schematic file:
Version 4
SHEET 1 880 824
WIRE -48 -208 -112 -208
WIRE 128 -208 128 -304
WIRE 128 -208 -48 -208
WIRE -48 -192 -48 -208
WIRE -112 -160 -112 -208
WIRE -96 -160 -112 -160
WIRE -160 -144 -160 -256
WIRE -96 -144 -160 -144
WIRE 96 -64 -128 -64
WIRE 128 -64 128 -208
WIRE 128 -64 96 -64
WIRE 208 -64 128 -64
WIRE 368 -64 208 -64
WIRE -128 -48 -128 -64
WIRE 96 -32 96 -64
WIRE -192 -16 -240 -16
WIRE 32 0 -64 0
WIRE -320 16 -320 -256
WIRE -192 16 -320 16
WIRE 272 16 160 16
WIRE 0 32 0 -144
WIRE 32 32 0 32
WIRE -240 80 -240 -16
WIRE -240 80 -384 80
WIRE 96 96 -128 96
WIRE 208 96 208 -64
WIRE 208 96 96 96
WIRE 96 112 96 96
WIRE -240 128 -240 80
WIRE -192 128 -240 128
WIRE 32 144 -48 144
WIRE -320 160 -320 16
WIRE -192 160 -320 160
WIRE 256 160 160 160
WIRE 0 176 0 32
WIRE 32 176 0 176
WIRE 368 176 368 -64
WIRE 272 208 272 16
WIRE 320 208 272 208
WIRE 480 208 416 208
WIRE 288 224 288 -128
WIRE 320 224 288 224
WIRE 256 240 256 160
WIRE 320 240 256 240
WIRE 464 240 416 240
WIRE 96 272 -128 272
WIRE 208 272 208 96
WIRE 208 272 96 272
WIRE 368 272 208 272
WIRE 96 288 96 272
WIRE -192 304 -240 304
WIRE 32 320 -64 320
WIRE -320 336 -320 160
WIRE -192 336 -320 336
WIRE 272 336 160 336
WIRE 368 336 368 272
WIRE 0 352 0 176
WIRE 32 352 0 352
WIRE 272 368 272 336
WIRE 320 368 272 368
WIRE 480 368 416 368
WIRE 288 384 288 224
WIRE 320 384 288 384
WIRE -240 400 -240 304
WIRE -240 400 -384 400
WIRE 320 400 256 400
WIRE 464 400 416 400
WIRE 96 416 -128 416
WIRE 208 416 208 272
WIRE 208 416 96 416
WIRE 96 432 96 416
WIRE -240 448 -240 400
WIRE -192 448 -240 448
WIRE 32 464 -48 464
WIRE -320 480 -320 336
WIRE -192 480 -320 480
WIRE 256 480 256 400
WIRE 256 480 160 480
WIRE 0 496 0 352
WIRE 32 496 0 496
WIRE 208 496 208 416
WIRE 368 496 208 496
WIRE 320 528 256 528
WIRE 480 528 416 528
WIRE 288 544 288 384
WIRE 320 544 288 544
WIRE 320 560 272 560
WIRE 464 560 416 560
WIRE 96 576 -128 576
WIRE 208 576 208 496
WIRE 208 576 96 576
WIRE 96 592 96 576
WIRE -192 608 -240 608
WIRE 32 624 -64 624
WIRE -320 640 -320 480
WIRE -192 640 -320 640
WIRE 256 640 256 528
WIRE 256 640 160 640
WIRE 0 656 0 496
WIRE 32 656 0 656
WIRE -240 688 -240 608
WIRE -240 688 -384 688
WIRE 96 720 -128 720
WIRE 208 720 208 576
WIRE 208 720 96 720
WIRE 96 736 96 720
WIRE -240 752 -240 688
WIRE -192 752 -240 752
WIRE 32 768 -48 768
WIRE -320 784 -320 640
WIRE -192 784 -320 784
WIRE 272 784 272 560
WIRE 272 784 160 784
WIRE 0 800 0 656
WIRE 32 800 0 800
FLAG 480 208 Y0
IOPIN 480 208 Out
FLAG 480 368 Y1
IOPIN 480 368 Out
FLAG 480 528 Y2
IOPIN 480 528 Out
FLAG -160 -256 SAVE
IOPIN -160 -256 In
FLAG 128 -304 VDD
IOPIN 128 -304 In
FLAG -320 -256 RESET
IOPIN -320 -256 In
FLAG 288 -128 C
IOPIN 288 -128 In
FLAG -384 400 Y1`
IOPIN -384 400 In
FLAG -384 688 Y2`
IOPIN -384 688 In
FLAG -384 80 Y0`
IOPIN -384 80 In
SYMBOL and -144 0 R0
SYMATTR InstName X5
SYMBOL and 80 16 R0
SYMATTR InstName X7
SYMBOL and 80 160 R0
SYMATTR InstName X8
SYMBOL nand -128 144 R0
SYMATTR InstName X6
SYMBOL and -144 320 R0
SYMATTR InstName X1
SYMBOL and 80 336 R0
SYMATTR InstName X2
SYMBOL and 80 480 R0
SYMATTR InstName X3
SYMBOL nand -128 464 R0
SYMATTR InstName X12
SYMBOL and -144 624 R0
SYMATTR InstName X13
SYMBOL and 80 640 R0
SYMATTR InstName X14
SYMBOL and 80 784 R0
SYMATTR InstName X15
SYMBOL nand -128 768 R0
SYMATTR InstName X16
SYMBOL jk-front 368 240 R0
SYMATTR InstName X17
SYMBOL jk-front 368 400 R0
SYMATTR InstName X18
SYMBOL jk-front 368 560 R0
SYMATTR InstName X19
SYMBOL xor -48 -144 R0
SYMATTR InstName X9

or3.asc, the sub-circuit schematic file:
Version 4
SHEET 1 880 680
WIRE 208 32 208 -32
WIRE 208 32 112 32
WIRE 288 32 208 32
WIRE 112 48 112 32
WIRE 288 64 288 32
WIRE 64 80 0 80
WIRE 64 96 16 96
WIRE 240 96 160 96
WIRE 16 112 16 96
WIRE 16 112 0 112
WIRE 240 112 176 112
WIRE 384 112 336 112
WIRE 176 160 176 112
WIRE 176 160 0 160
FLAG 0 80 A
IOPIN 0 80 In
FLAG 0 112 B
IOPIN 0 112 In
FLAG 0 160 C
IOPIN 0 160 In
FLAG 384 112 OUT
IOPIN 384 112 Out
FLAG 208 -32 VDD
IOPIN 208 -32 In
SYMBOL or 128 96 R0
SYMATTR InstName X1
SYMBOL or 304 112 R0
SYMATTR InstName X2

The netlist it stands for:
* 4_exp1.asc
V5 N007 0 PWL(0n 0 1n 0 1.01n 1)
V6 vdd 0 1
V1 N008 0 PULSE(0 1 0.5n 10p 10p 2n 4n)
V7 N001 0 PULSE(0 1 6n 10p 10p 8n 16n)
V8 N003 0 PULSE(0 1 2n 10p 10p 8n 16n)
V9 N005 0 PULSE(0 1 18n 10p 10p 8n 16n)
R2 N002 0 100k
C2 N002 0 0.01f
R3 N004 0 100k
C3 N004 0 0.01f
R4 N006 0 100k
C4 N006 0 0.01f
XX1 vdd N001 N003 N005 N007 N008 N002 N004 N006 4_automat2

* block symbol definitions
.subckt 4_automat2 VDD X0 X1 X2 RESET C Y0 Y1 Y2
XX1 X0 X1 X2 N012 N009 VDD and4
XX2 N007 N014 N015 VDD N008 and3
XX3 N009 N008 VDD N001 or
XX4 X0 N014 X2 N012 N010 VDD and4
XX5 X0 N014 N020 N019 N017 VDD and4
XX6 N010 N017 VDD N002 or
XX7 X0 X1 N020 N012 N003 VDD and4
XX8 N007 X1 N020 N021 N005 VDD and4
XX9 X0 X2 N018 VDD N006 and3
XX12 N004 VDD N001 N002 N003 N005 N006 nor5
XX13 N001 N002 N003 N005 N006 RESET VDD C N004 N018 N015 N019 N012 N021 4_saver
XX10 VDD RESET C N004 N011 N013 N016 Y0 Y1 Y2 4_exit_saver
XX14 N008 N010 VDD N011 or
XX17 N003 N005 N006 VDD N013 or3
XX18 N009 N017 VDD N016 or
XX11 X0 VDD N007 inverter
XX15 X1 VDD N014 inverter
XX16 X2 VDD N020 inverter
.ends 4_automat2

.subckt and4 A B C D OUT VDD
M1 N001 A P001 0 NMOS l=90n w=200n
M2 P001 B N002 0 NMOS l=90n w=200n
M3 VDD A N001 VDD PMOS l=90n w=400n
M4 VDD B N001 VDD PMOS l=90n w=400n
M5 N002 C N003 0 NMOS l=90n w=200n
M6 VDD C N001 VDD PMOS l=90n w=400n
M7 VDD D N001 VDD PMOS l=90n w=400n
M8 N003 D 0 0 NMOS l=90n w=200n
M9 OUT N001 0 0 NMOS l=90n w=200n
M10 VDD N001 OUT VDD PMOS l=90n w=400n
.param T_SIZE=1
.ends and4

.subckt and3 A B C VDD OUT
XX1 VDD A B N001 and
XX2 VDD N001 C OUT and
.ends and3

.subckt and VDD A B OUT
M1 N001 A P001 0 NMOS l=90n w=200n
M2 P001 B 0 0 NMOS l=90n w=200n
M3 VDD A N001 VDD PMOS l=90n w=400n
M4 VDD B N001 VDD PMOS l=90n w=400n
M5 OUT N001 0 0 NMOS l=90n w=200n
M6 VDD N001 OUT VDD PMOS l=90n w=400n
.ends and

.subckt or A B VDD OUT
M1 VDD A P001 VDD PMOS l=90n w=400n
M2 P001 B N001 VDD PMOS l=90n w=400n
M3 N001 A 0 0 NMOS l=90n w=200n
M4 N001 B 0 0 NMOS l=90n w=200n
M5 OUT N001 0 0 NMOS l=90n w=200n
M6 VDD N001 OUT VDD PMOS l=90n w=400n
.ends or

.subckt nor5 out VDD in1 in2 in3 in4 in5
XX1 in1 in2 VDD N001 or
XX2 in3 in4 VDD N002 or
XX3 N001 N002 VDD N003 or
XX4 N003 in5 VDD N004 or
XX5 N004 VDD out inverter
.ends nor5

.subckt inverter VIN VDD VOUT
M1 VOUT VIN 0 0 NMOS l=90n w='{T_SIZE}*200n'
M2 VDD VIN VOUT VDD PMOS l=90n w='{T_SIZE}*400n'
.param T_SIZE=1
.ends inverter

.subckt 4_saver B4` B3` B2` B1` B0` RESET VDD C SAVE B4 B3 B2 B1 B0
XX15 VDD RESET B4` N002 and
XX17 VDD N002 N001 N003 and
XX18 VDD N004 N001 N005 and
XX24 VDD RESET B3` N007 and
XX26 VDD N007 N001 N008 and
XX27 VDD N011 N001 N009 and
XX28 VDD RESET B2` N015 and
XX30 VDD N015 N001 N012 and
XX31 VDD N019 N001 N013 and
XX32 VDD RESET B1` N023 and
XX34 VDD N023 N001 N016 and
XX35 VDD N024 N001 N017 and
XX19 N003 C N005 VDD B4 N006 jk-front
XX20 N008 C N009 VDD B3 N010 jk-front
XX21 N012 C N013 VDD B2 N014 jk-front
XX22 N016 C N017 VDD B1 N018 jk-front
XX23 N020 C N021 VDD B0 N022 jk-front
XX14 VDD RESET B0` N025 and
XX38 VDD N026 N001 N020 and
XX39 VDD N027 N001 N021 and
XX40 VDD SAVE VDD N001 xor
XX1 N002 VDD N004 inverter
XX2 N007 VDD N011 inverter
XX3 N015 VDD N019 inverter
XX4 N023 VDD N024 inverter
XX5 N025 N028 VDD N026 or
XX6 RESET VDD N028 inverter
XX7 N026 VDD N027 inverter
.ends 4_saver

.subckt jk-front J C K VDD Q !Q
XX1 VDD !Q J N001 and
XX2 VDD Q K N007 and
XX3 N001 N003 N002 VDD nand
XX4 N007 N003 N008 VDD nand
XX5 N002 N005 N004 VDD nand
XX6 N008 N004 N005 VDD nand
XX8 N004 C N006 VDD nand
XX9 N005 C N009 VDD nand
XX10 N006 !Q Q VDD nand
XX11 N009 Q !Q VDD nand
XX12 C VDD N003 inverter
.ends jk-front

.subckt nand A B OUT VDD
M1 OUT A P001 0 NMOS l=90n w=200n
M2 P001 B 0 0 NMOS l=90n w=200n
M3 VDD A OUT VDD PMOS l=90n w=400n
M4 VDD B OUT VDD PMOS l=90n w=400n
.ends nand

.subckt xor a b vdd out
XX1 a b N002 vdd nand
XX2 a N002 N001 vdd nand
XX3 N002 b N003 vdd nand
XX4 N001 N003 out vdd nand
.ends xor

.subckt 4_exit_saver VDD RESET C SAVE Y0` Y1` Y2` Y0 Y1 Y2
XX5 VDD Y0` RESET N001 and
XX7 VDD N001 N003 N002 and
XX8 VDD N004 N003 N005 and
XX6 Y0` RESET N004 VDD nand
XX1 VDD Y1` RESET N007 and
XX2 VDD N007 N003 N008 and
XX3 VDD N011 N003 N009 and
XX12 Y1` RESET N011 VDD nand
XX13 VDD Y2` RESET N015 and
XX14 VDD N015 N003 N012 and
XX15 VDD N016 N003 N013 and
XX16 Y2` RESET N016 VDD nand
XX17 N002 C N005 VDD Y0 N006 jk-front
XX18 N008 C N009 VDD Y1 N010 jk-front
XX19 N012 C N013 VDD Y2 N014 jk-front
XX9 VDD SAVE VDD N003 xor
.ends 4_exit_saver

.subckt or3 A B C VDD OUT
XX1 A B VDD N001 or
XX2 N001 C VDD OUT or
.ends or3

.model NMOS NMOS
.model PMOS PMOS
.lib standard.mos
.include 90nm_bulk.txt
.tran 0 26n 0 1p
.backanno
.end

* Results of the author's LTspice run, read from the files saved beside the schematic
* Operating Point, zero values left out:
*   V(vdd) = 1 V
*   V(n002) = 489.6 mV
*   V(n004) = 489.6 mV
*   V(n006) = 489.6 mV
*   I(R4) = 4.896 µA
*   I(R3) = 4.896 µA
*   I(R2) = 4.896 µA
*   I(V9) = 139.7 pA
*   I(V8) = 188.6 pA
*   I(V7) = 785.6 pA
*   I(V1) = 1.122 nA
*   I(V6) = -488.1 µA
*   I(V5) = 803.1 pA
*   Ix(x1:VDD) = 488.1 µA
*   Ix(x1:X0) = -785.6 pA
*   Ix(x1:X1) = -188.6 pA
*   Ix(x1:X2) = -139.7 pA
*   Ix(x1:RESET) = -803.1 pA
*   Ix(x1:C) = -1.122 nA
*   Ix(x1:Y0) = -4.896 µA
*   Ix(x1:Y1) = -4.896 µA
*   Ix(x1:Y2) = -4.896 µA
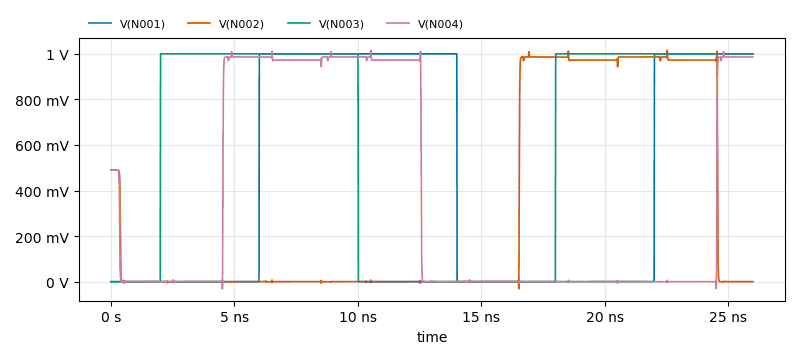
[diagram p8: Transient Analysis of 4_exp1.asc, plotted from the saved traces]
* Transient Analysis, 1 run:
*   V(N001): min 0 V, max 1 V, average 461.7 mV, rms 679.4 mV, last 1 V
*   V(N002): min -31.22 mV, max 1.015 V, average 309.5 mV, rms 546.7 mV, last 55.48 µV
*   V(N003): min 0 V, max 1 V, average 615.6 mV, rms 784.5 mV, last 1 V
*   V(N004): min -31.29 mV, max 1.015 V, average 364.2 mV, rms 594 mV, last 986.2 mV